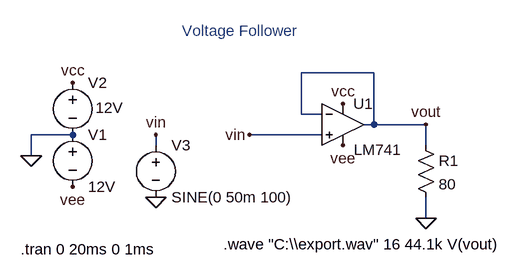
[diagram p0: schematic opamp_voltage_follower.asc]
opamp_voltage_follower.asc, the LTspice schematic file:
Version 4.1
SHEET 1 880 680
WIRE 416 112 304 112
WIRE 304 176 304 112
WIRE 336 176 304 176
WIRE 416 192 416 112
WIRE 416 192 400 192
WIRE 496 192 416 192
WIRE -48 208 -112 208
WIRE 336 208 224 208
WIRE 80 224 80 208
WIRE 496 224 496 192
WIRE -112 240 -112 208
WIRE 496 336 496 304
FLAG -112 240 0
FLAG -48 128 vcc
FLAG -48 288 vee
FLAG 368 160 vcc
FLAG 368 224 vee
FLAG 80 304 0
FLAG 80 208 vin
FLAG 224 208 vin
FLAG 496 336 0
FLAG 496 192 vout
SYMBOL LM741 368 128 R0
WINDOW 3 17 103 Left 2
SYMATTR InstName U1
SYMBOL voltage -48 192 R0
WINDOW 123 0 0 Left 0
WINDOW 39 0 0 Left 0
SYMATTR InstName V1
SYMATTR Value 12V
SYMBOL voltage -48 112 R0
WINDOW 3 35 54 Left 2
WINDOW 123 0 0 Left 0
WINDOW 39 0 0 Left 0
SYMATTR Value 12V
SYMATTR InstName V2
SYMBOL voltage 80 208 R0
WINDOW 123 0 0 Left 0
WINDOW 39 0 0 Left 0
SYMATTR InstName V3
SYMATTR Value SINE(0 50m 100)
SYMBOL res 480 208 R0
SYMATTR InstName R1
SYMATTR Value 80
TEXT 120 48 Left 2 ;Voltage Follower
TEXT -128 384 Left 2 !.tran 0 20ms 0 1ms
TEXT 184 376 Left 2 !.wave "C:\\\\export.wav" 16 44.1k V(vout)

The netlist it stands for:
* opamp_voltage_follower.asc
X§U1 vin vout vcc vee vout LM741  ; pins In+ In- V+ V- OUT
V1 0 vee 12V
V2 vcc 0 12V
V3 vin 0 SINE(0 50m 100)
R1 vout 0 80
* Voltage Follower
.tran 0 20ms 0 1ms
.wave "C:\\export.wav" 16 44.1k V(vout)
.lib LM741.lib
.backanno
.end